# Altium project Activity_Recognition_Board_V1.0.PrjPcb
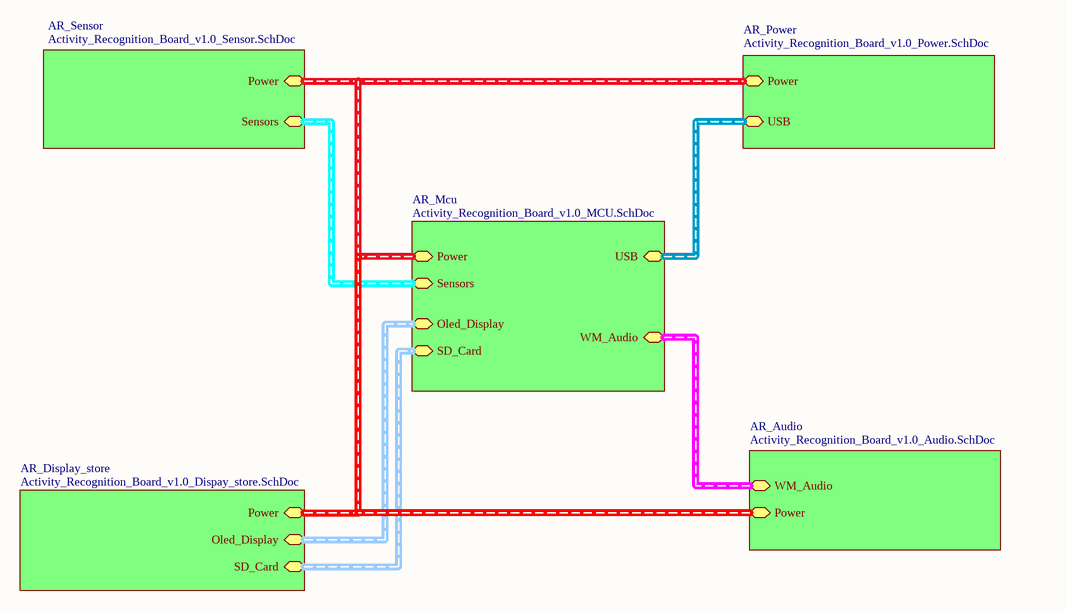
[diagram p0: Activity_Recognition_Board_v1.0_TOP.SchDoc]
7 sheets, 119 parts. Net scope: hierarchical (ports join the sheet entries above them; power ports are global).
Board file: Activity_Recognition_Board_v1.0_PCB.PcbDoc
Sheets:
  Activity_Recognition_Board_v1.0_TOP.SchDoc
    AR_Mcu = Activity_Recognition_Board_v1.0_MCU.SchDoc
    AR_Power = Activity_Recognition_Board_v1.0_Power.SchDoc
    AR_Sensor = Activity_Recognition_Board_v1.0_Sensor.SchDoc
    AR_Display_store = Activity_Recognition_Board_v1.0_Dispay_store.SchDoc
    AR_Audio = Activity_Recognition_Board_v1.0_Audio.SchDoc
  Sheet1.SchDoc

## Sheet Activity_Recognition_Board_v1.0_TOP.SchDoc
size A4

### Sub-sheets
AR_Audio = Activity_Recognition_Board_v1.0_Audio.SchDoc: Power (harness Power), WM_Audio (harness WM_Audio)
AR_Display_store = Activity_Recognition_Board_v1.0_Dispay_store.SchDoc: SD_Card (harness SD_Card), Power (harness Power), Oled_Display (harness Oled_Display)
AR_Mcu = Activity_Recognition_Board_v1.0_MCU.SchDoc: SD_Card (harness SD_Card), Power (harness Power), Sensors (harness Sensors), USB (harness USB), Oled_Display (harness Oled_Display), WM_Audio (harness WM_Audio)
AR_Power = Activity_Recognition_Board_v1.0_Power.SchDoc: Power (harness Power), USB (harness USB)
AR_Sensor = Activity_Recognition_Board_v1.0_Sensor.SchDoc: Sensors (harness Sensors), Power (harness Power)

### Buses and harness runs
harness sheet AR_Audio/Power = sheet AR_Display_store/Power = sheet AR_Mcu/Power = sheet AR_Power/Power = sheet AR_Sensor/Power
harness sheet AR_Audio/WM_Audio = sheet AR_Mcu/WM_Audio
harness sheet AR_Display_store/Oled_Display = sheet AR_Mcu/Oled_Display
harness sheet AR_Display_store/SD_Card = sheet AR_Mcu/SD_Card
harness sheet AR_Mcu/Sensors = sheet AR_Sensor/Sensors
harness sheet AR_Mcu/USB = sheet AR_Power/USB

## Sheet Activity_Recognition_Board_v1.0_MCU.SchDoc
size A4
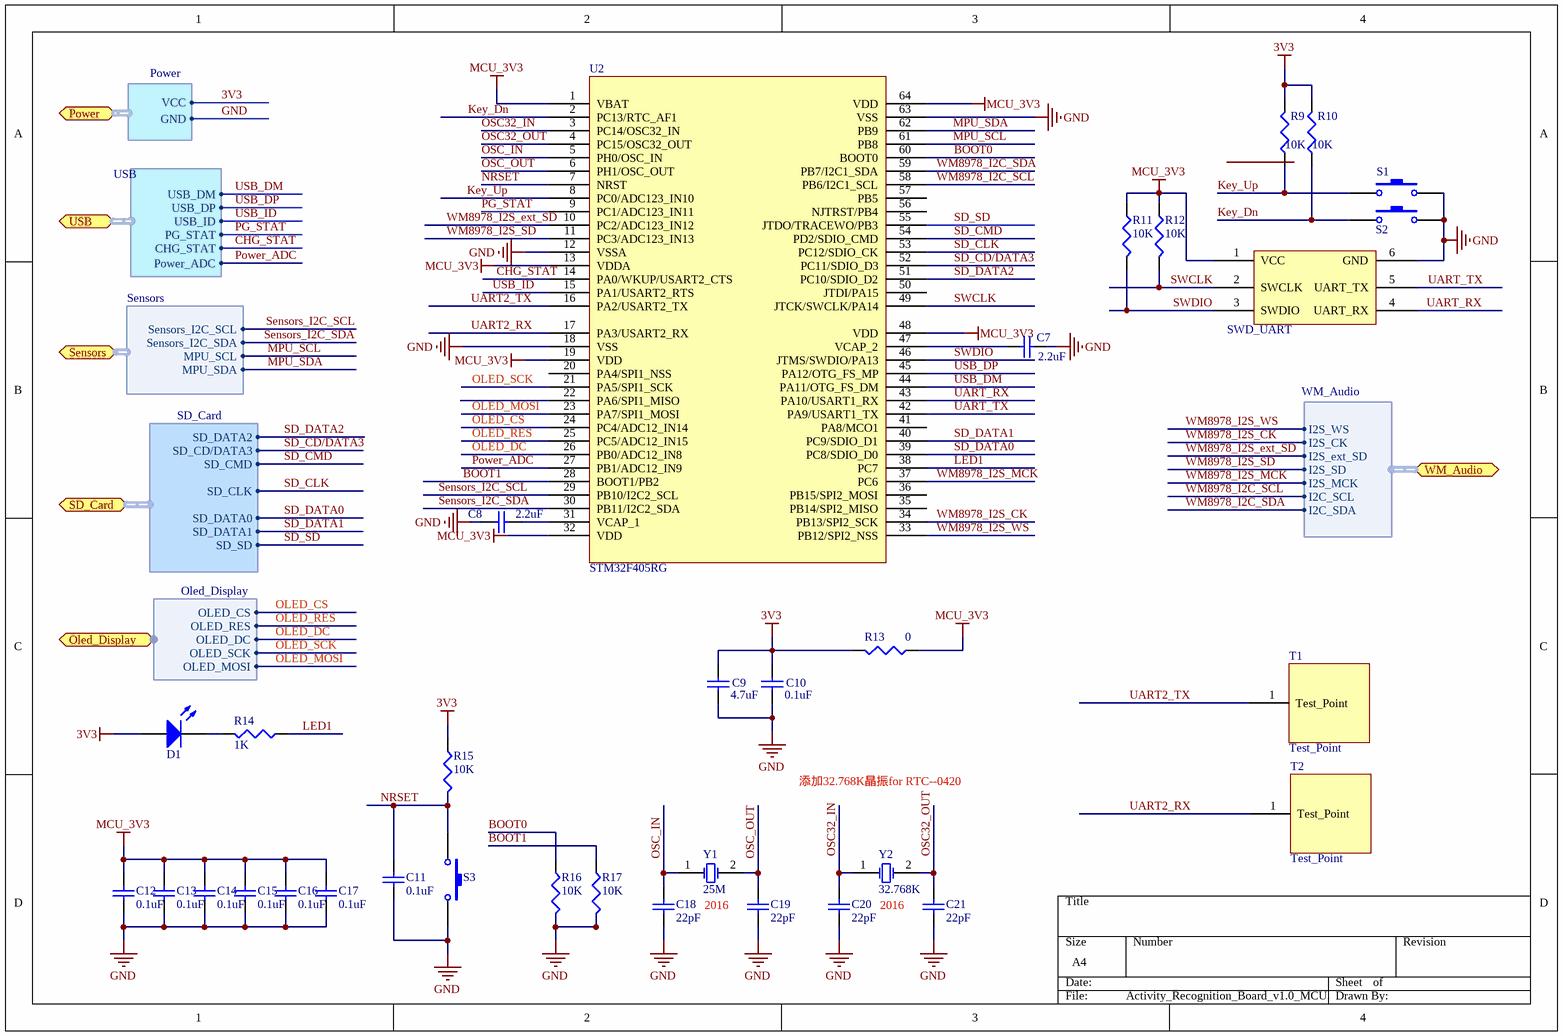
[diagram p1: Activity_Recognition_Board_v1.0_MCU.SchDoc]

### Parts
C7  value 2.2uF  [C0603]  (hidden comment: Cap semi)
C8  value 2.2uF  [C0603]  (hidden comment: Cap semi)
C9  value 4.7uF  [C0603]  (hidden comment: Cap semi)
C10  value 0.1uF  [C0402]  (hidden comment: Cap semi)
C11  value 0.1uF  [C0402]  (hidden comment: Cap semi)
C12  value 0.1uF  [C0402]  (hidden comment: Cap semi)
C13  value 0.1uF  [C0402]  (hidden comment: Cap semi)
C14  value 0.1uF  [C0402]  (hidden comment: Cap semi)
C15  value 0.1uF  [C0402]  (hidden comment: Cap semi)
C16  value 0.1uF  [C0402]  (hidden comment: Cap semi)
C17  value 0.1uF  [C0402]  (hidden comment: Cap semi)
C18  value 22pF  [C0402]  (hidden comment: Cap semi)
C19  value 22pF  [C0402]  (hidden comment: Cap semi)
C20  value 22pF  [C0402]  (hidden comment: Cap semi)
C21  value 22pF  [C0402]  (hidden comment: Cap semi)
D1  LED3  [LED0603]  (value not drawn)
R9  value 10K  [R0402]  (hidden comment: Res3)
R10  value 10K  [R0402]  (hidden comment: Res3)
R11  value 10K  [R0402]  (hidden comment: Res3)
R12  value 10K  [R0402]  (hidden comment: Res3)
R13  value 0  [R0603]  (hidden comment: Res3)
R14  value 1K  [R0402]  (hidden comment: Res3)
R15  value 10K  [R0402]  (hidden comment: Res3)
R16  value 10K  [R0402]  (hidden comment: Res3)
R17  value 10K  [R0402]  (hidden comment: Res3)
S1  SW-PB  [MP34]  (value not drawn)
S2  SW-PB  [MP34]  (value not drawn)
S3  SW-PB  [MP34]  (value not drawn)
SWD_UART1  SWD_UART  [FFC_6]
T1  Test_Point  [Test_Point]
T2  Test_Point  [Test_Point]
U2  STM32F405RG  [LQFP64]
Y1  25M  [3225]
Y2  32.768K  [3215]

### Ports
Oled_Display (harness Oled_Display), Power (harness Power), SD_Card (harness SD_Card), Sensors (harness Sensors), USB (harness USB), WM_Audio (harness WM_Audio)

### Harnesses
Power: VCC, GND
USB: USB_DM, USB_DP, USB_ID, PG_STAT, CHG_STAT, Power_ADC
Sensors: Sensors_I2C_SCL, Sensors_I2C_SDA, MPU_SDA, MPU_SCL
SD_Card: SD_DATA2, SD_CMD, SD_CD/DATA3, SD_CLK, SD_DATA0, SD_DATA1, SD_SD
WM_Audio: I2S_WS, I2S_CK, I2S_ext_SD, I2S_SD, I2S_MCK, I2C_SCL, I2C_SDA
Oled_Display: OLED_CS, OLED_RES, OLED_DC, OLED_SCK, OLED_MOSI

### Nets
3V3: C9.1 C10.1 D1.1(A) R9.2 R10.2 R13.2 R15.1 ; port Power.VCC
GND: C7.1 C8.2 C9.2 C10.2 C11.1 C12.1 C13.1 C14.1 C15.1 C16.1 C17.1 C18.1 C19.1 C20.1 C21.1 R16.2 R17.2 S1.2 S2.2 S3.2 SWD_UART1.6(GND) U2.12(VSSA) U2.18(VSS) U2.63(VSS) ; port Power.GND
MCU_3V3: C12.2 C13.2 C14.2 C15.2 C16.2 C17.2 R11.1 R12.1 R13.1 SWD_UART1.1(VCC) U2.1(VBAT) U2.13(VDDA) U2.19(VDD) U2.32(VDD) U2.48(VDD) U2.64(VDD)
BOOT0: R16.1 U2.60(BOOT0)
BOOT1: R17.1 U2.28(BOOT1/PB2)
CHG_STAT: U2.14(PA0/WKUP/USART2_CTS) ; port USB.CHG_STAT
Key_Dn: R10.1 S2.1 U2.2(PC13/RTC_AF1)
Key_Up: R9.1 S1.1 U2.8(PC0/ADC123_IN10)
LED1: R14.1 U2.38(PC7)
MPU_SCL: U2.61(PB8) ; port Sensors.MPU_SCL
MPU_SDA: U2.62(PB9) ; port Sensors.MPU_SDA
NRSET: C11.2 R15.2 S3.1 U2.7(NRST)
OLED_CS: U2.24(PC4/ADC12_IN14) ; port Oled_Display.OLED_CS
OLED_DC: U2.26(PB0/ADC12_IN8) ; port Oled_Display.OLED_DC
OLED_MOSI: U2.23(PA7/SPI1_MOSI) ; port Oled_Display.OLED_MOSI
OLED_RES: U2.25(PC5/ADC12_IN15) ; port Oled_Display.OLED_RES
OLED_SCK: U2.21(PA5/SPI1_SCK) ; port Oled_Display.OLED_SCK
OSC32_IN: C20.2 U2.3(PC14/OSC32_IN) Y2.1(OSC1)
OSC32_OUT: C21.2 U2.4(PC15/OSC32_OUT) Y2.2(OSC2)
OSC_IN: C18.2 U2.5(PH0/OSC_IN) Y1.1(OSC1)
OSC_OUT: C19.2 U2.6(PH1/OSC_OUT) Y1.2(OSC2)
PG_STAT: U2.9(PC1/ADC123_IN11) ; port USB.PG_STAT
Power_ADC: U2.27(PB1/ADC12_IN9) ; port USB.Power_ADC
SD_CD/DATA3: U2.52(PC11/SDIO_D3) ; port SD_Card.SD_CD/DATA3
SD_CLK: U2.53(PC12/SDIO_CK) ; port SD_Card.SD_CLK
SD_CMD: U2.54(PD2/SDIO_CMD) ; port SD_Card.SD_CMD
SD_DATA0: U2.39(PC8/SDIO_D0) ; port SD_Card.SD_DATA0
SD_DATA1: U2.40(PC9/SDIO_D1) ; port SD_Card.SD_DATA1
SD_DATA2: U2.51(PC10/SDIO_D2) ; port SD_Card.SD_DATA2
SD_SD: U2.55(JTDO/TRACEWO/PB3) ; port SD_Card.SD_SD
Sensors_I2C_SCL: U2.29(PB10/I2C2_SCL) ; port Sensors.Sensors_I2C_SCL
Sensors_I2C_SDA: U2.30(PB11/I2C2_SDA) ; port Sensors.Sensors_I2C_SDA
SWCLK: R12.2 SWD_UART1.2(SWCLK) U2.49(JTCK/SWCLK/PA14)
SWDIO: R11.2 SWD_UART1.3(SWDIO) U2.46(JTMS/SWDIO/PA13)
UART2_RX: T2.1(Test_Point) U2.17(PA3/USART2_RX)
UART2_TX: T1.1(Test_Point) U2.16(PA2/USART2_TX)
UART_RX: SWD_UART1.4(UART_RX) U2.43(PA10/USART1_RX)
UART_TX: SWD_UART1.5(UART_TX) U2.42(PA9/USART1_TX)
USB_DM: U2.44(PA11/OTG_FS_DM) ; port USB.USB_DM
USB_DP: U2.45(PA12/OTG_FS_MP) ; port USB.USB_DP
USB_ID: U2.15(PA1/USART2_RTS) ; port USB.USB_ID
WM8978_I2C_SCL: U2.58(PB6/I2C1_SCL) ; port WM_Audio.I2C_SCL  [project net I2C_SCL]
WM8978_I2C_SDA: U2.59(PB7/I2C1_SDA) ; port WM_Audio.I2C_SDA  [project net I2C_SDA]
WM8978_I2S_CK: U2.34(PB13/SPI2_SCK) ; port WM_Audio.I2S_CK  [project net I2S_CK]
WM8978_I2S_ext_SD: U2.10(PC2/ADC123_IN12) ; port WM_Audio.I2S_ext_SD  [project net I2S_ext_SD]
WM8978_I2S_MCK: U2.37(PC6) ; port WM_Audio.I2S_MCK  [project net I2S_MCK]
WM8978_I2S_SD: U2.11(PC3/ADC123_IN13) ; port WM_Audio.I2S_SD  [project net I2S_SD]
WM8978_I2S_WS: U2.33(PB12/SPI2_NSS) ; port WM_Audio.I2S_WS  [project net I2S_WS]
NetC7_2: C7.2 U2.47(VCAP_2)
NetC8_1: C8.1 U2.31(VCAP_1)
NetD1_2: D1.2(K) R14.2

Not connected (* = marked no-connect by the designer): U2 20(PA4/SPI1_NSS) 22(PA6/SPI1_MISO) 35(PB14/SPI2_MISO) 36(PB15/SPI2_MOSI) 41(PA8/MCO1) 50(JTDI/PA15) 56(NJTRST/PB4) 57(PB5)

### Notes on the sheet
- 添加32.768K晶振for RTC--0420
- 2016

### Library data of the parts
C7-C21 = Cap semi: Capacitor (Semiconductor SIM Model); Published: 8-Jun-2000; LatestRevisionDate: 29-May-2009; LatestRevisionNote: IPC-7351 Footprint Added.; PackageReference: C1206; Publisher: Altium Limited; PackageDescription: Chip Capacitor
D1 = LED3: Typical BLUE SiC LED; Published: 8-Jun-2000; LatestRevisionDate: 17-Dec-2003; LatestRevisionNote: PCB Footprint replaced.; DatasheetVersion: 16-Apr-2002; PackageVersion: 16-Apr-2002; PackageReference: 3.5X2.8X1.9; Publisher: Altium Limited; PackageDescription: SM LED; 2 C-Bend Leads; Body 3.5 x 2.8 x 1.9 mm, inc leads (LxWxH typ)
R9-R17 = Res3: Resistor; Published: 8-Jun-2000; LatestRevisionDate: 29-May-2009; LatestRevisionNote: IPC-7351 Footprint Added.; PackageReference: J1-0603; Publisher: Altium Limited; PackageDescription: Chip Resistor
S1-S3 = SW-PB: Switch; Published: 24-Mar-1999; LatestRevisionDate: 17-Jul-2002; LatestRevisionNote: Re-released for DXP Platform.; PackageReference: SPST-2; Publisher: Altium Limited; PackageDescription: Switch; 2 Leads
Y1 = XTAL: Crystal Oscillator; pin to pad: 2>3; Published: 8-Jun-2000; LatestRevisionDate: 17-Jul-2002; LatestRevisionNote: Re-released for DXP Platform.; PackageReference: R38; Publisher: Altium Limited; PackageDescription: Crystal, Thru-Hole; 2 Leads; Body 3.1 x 8.2 mm (Dia.xH)
Y2 = XTAL: Crystal Oscillator; Published: 8-Jun-2000; LatestRevisionDate: 17-Jul-2002; LatestRevisionNote: Re-released for DXP Platform.; PackageReference: R38; Publisher: Altium Limited; PackageDescription: Crystal, Thru-Hole; 2 Leads; Body 3.1 x 8.2 mm (Dia.xH)

## Sheet Activity_Recognition_Board_v1.0_Power.SchDoc
size A4
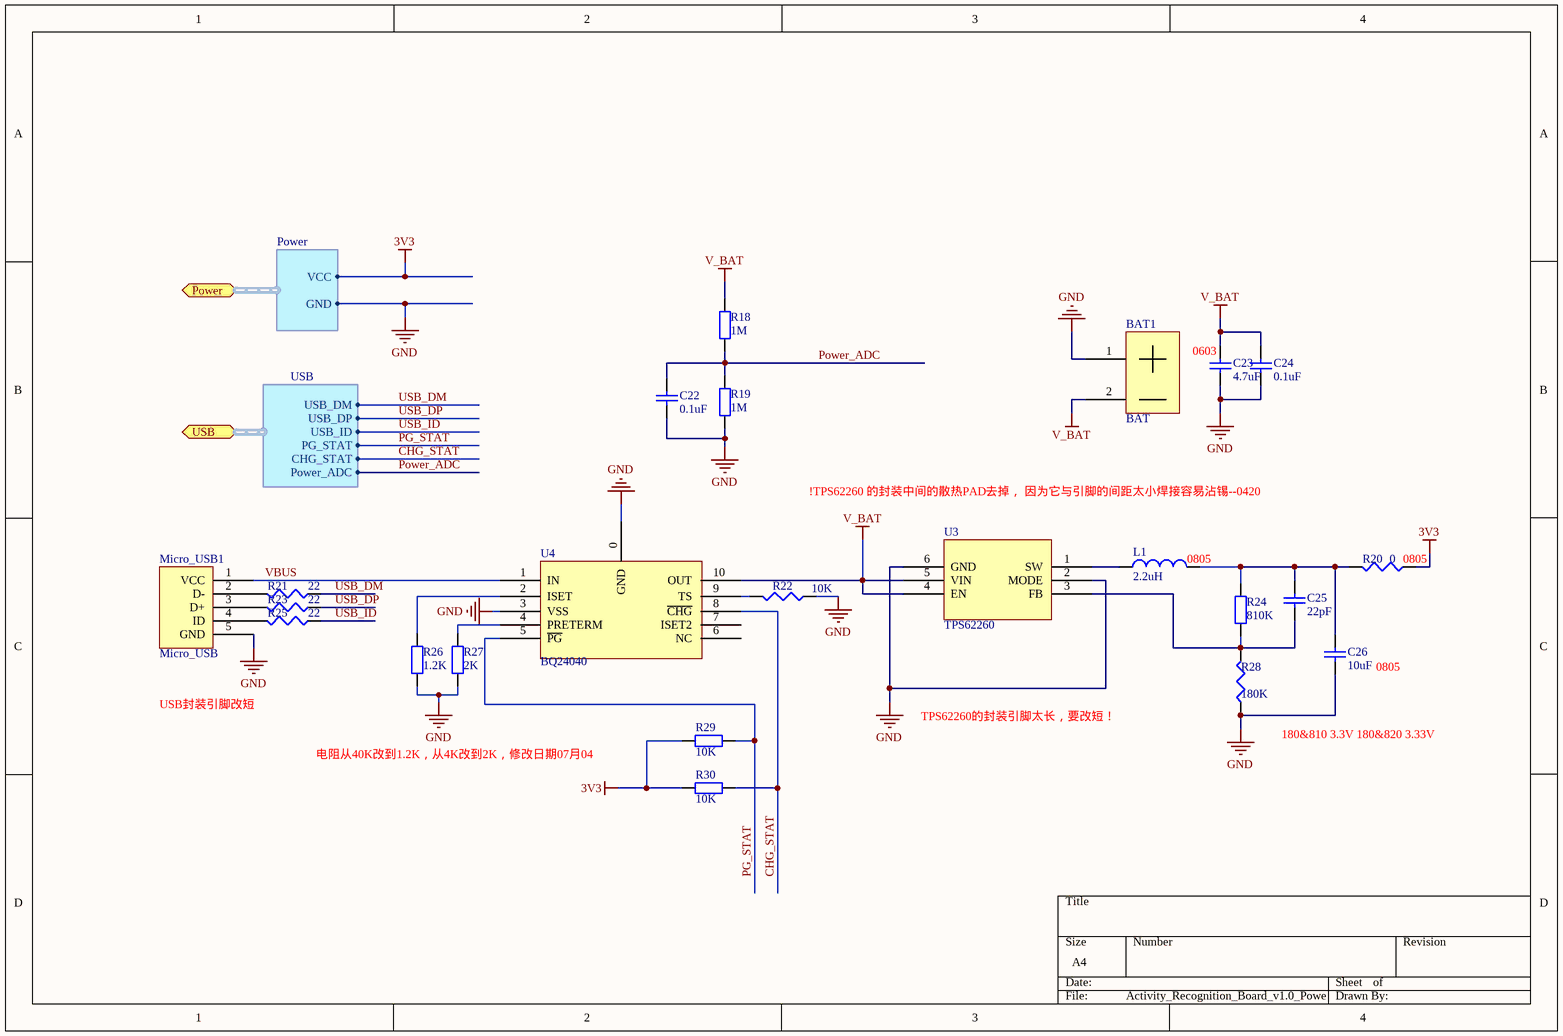
[diagram p2: Activity_Recognition_Board_v1.0_Power.SchDoc]

### Parts
(Parts that share a designator on the sheet are numbered #1, #2 ... from top to bottom, then left to right.)
BAT1  BAT  [BHDR2_1.87]
C22  value 0.1uF  [C0402]  (hidden comment: Cap semi)
C23  value 4.7uF  [C0603]  (hidden comment: Cap semi)
C24  value 0.1uF  [C0402]  (hidden comment: Cap semi)
C25  value 22pF  [C0402]  (hidden comment: Cap semi)
C26  value 10uF  [C0805]  (hidden comment: Cap semi)
L1#1  value 2.2uH  [L0805]  (hidden comment: Inductor)
Micro_USB1  Micro_USB  [Micro_USB]
R18  value 1M  [R0402]  (hidden comment: Res2)
R19  value 1M  [R0402]  (hidden comment: Res2)
R20  value 0  [R0805]  (hidden comment: Res3)
R21  value 22  [R0402]  (hidden comment: Res3)
R22  value 10K  [R0402]  (hidden comment: Res3)
R23  value 22  [R0402]  (hidden comment: Res3)
R24  value 810K  [R0402]  (hidden comment: Res2)
R25  value 22  [R0402]  (hidden comment: Res3)
R26  value 1.2K  [R0402]  (hidden comment: Res2)
R27  value 2K  [R0402]  (hidden comment: Res2)
R28  value 180K  [R0402]  (hidden comment: Res3)
R29  value 10K  [R0402]  (hidden comment: Res2)
R30  value 10K  [R0402]  (hidden comment: Res2)
U3  TPS62260  [QFN-6]
U4  BQ24040  [WSON10]

### Ports
Power (harness Power), USB (harness USB)

### Harnesses
Power: VCC, GND
USB: USB_DM, USB_DP, USB_ID, PG_STAT, CHG_STAT, Power_ADC

### Nets
3V3: R20.1 R29.1 R30.1 ; port Power.VCC
GND: BAT1.1(+) C22.1 C23.1 C24.1 C26.1 Micro_USB1.5(GND) R19.2 R22.1 R26.1 R27.1 R28.1 U3.2(MODE) U3.6(GND) U4.0(GND) U4.3(VSS) ; port Power.GND
V_BAT: BAT1.2(-) C23.2 C24.2 R18.1 U3.4(EN) U3.5(VIN) U4.10(OUT)
CHG_STAT: R30.2 U4.8(~{CHG}) ; port USB.CHG_STAT
PG_STAT: R29.2 U4.5(~{PG}) ; port USB.PG_STAT
Power_ADC: C22.2 R18.2 R19.1 ; port USB.Power_ADC
USB_DM: R21.1 ; port USB.USB_DM
USB_DP: R23.1 ; port USB.USB_DP
USB_ID: R25.1 ; port USB.USB_ID
VBUS: Micro_USB1.1(VCC) U4.1(IN)
NetC25_1: C25.1 R24.1 R28.2 U3.3(FB)
NetC25_2: C25.2 C26.2 L1#1.2 R20.2 R24.2
NetL1#1_1: L1#1.1 U3.1(SW)
NetMicro_USB1_2: Micro_USB1.2(D-) R21.2
NetMicro_USB1_3: Micro_USB1.3(D+) R23.2
NetMicro_USB1_4: Micro_USB1.4(ID) R25.2
NetR22_2: R22.2 U4.9(TS)
NetR26_2: R26.2 U4.2(ISET)
NetR27_2: R27.2 U4.4(PRETERM)

Not connected (* = marked no-connect by the designer): U4 6(NC) 7(ISET2)

### Notes on the sheet
- (near C23) 0603
- !TPS62260 的封装中间的散热PAD去掉， 因为它与引脚的间距太小焊接容易沾锡--0420
- (near L1#1) 0805
- (near R20) 0805
- (near C26) 0805
- 180&810 3.3V 180&820 3.33V
- Labels drawn without touching a wire or pin: TPS62260的封装引脚太长，要改短！, USB封装引脚改短, 电阻从40K改到1.2K，从4K改到2K，修改日期07月04

### Library data of the parts
BAT1 = BAT_CN
C22-C26 = Cap semi: Capacitor (Semiconductor SIM Model); Published: 8-Jun-2000; LatestRevisionDate: 29-May-2009; LatestRevisionNote: IPC-7351 Footprint Added.; PackageReference: C1206; Publisher: Altium Limited; PackageDescription: Chip Capacitor
L1#1 = Inductor: Code_IEC: 1005; Published: 8-Jun-2000; LatestRevisionDate: 29-May-2009; LatestRevisionNote: IPC-7351 Footprint Added.; PackageReference: 0402-A; Publisher: Altium Limited; PackageDescription: Chip Inductor; Code_JEITA: 0402
Micro_USB1 = Micri_USB
R18 R19 R24 R26 R27 R29 R30 = Res2: Resistor; Published: 8-Jun-2000; LatestRevisionDate: 17-Jul-2002; LatestRevisionNote: Re-released for DXP Platform.; PackageReference: AXIAL-0.4; Publisher: Altium Limited
R20-R23 R25 R28 = Res3: Resistor; Published: 8-Jun-2000; LatestRevisionDate: 29-May-2009; LatestRevisionNote: IPC-7351 Footprint Added.; PackageReference: J1-0603; Publisher: Altium Limited; PackageDescription: Chip Resistor
U3 = TPS62260: DC-DC buck

## Sheet Activity_Recognition_Board_v1.0_Sensor.SchDoc
size A4
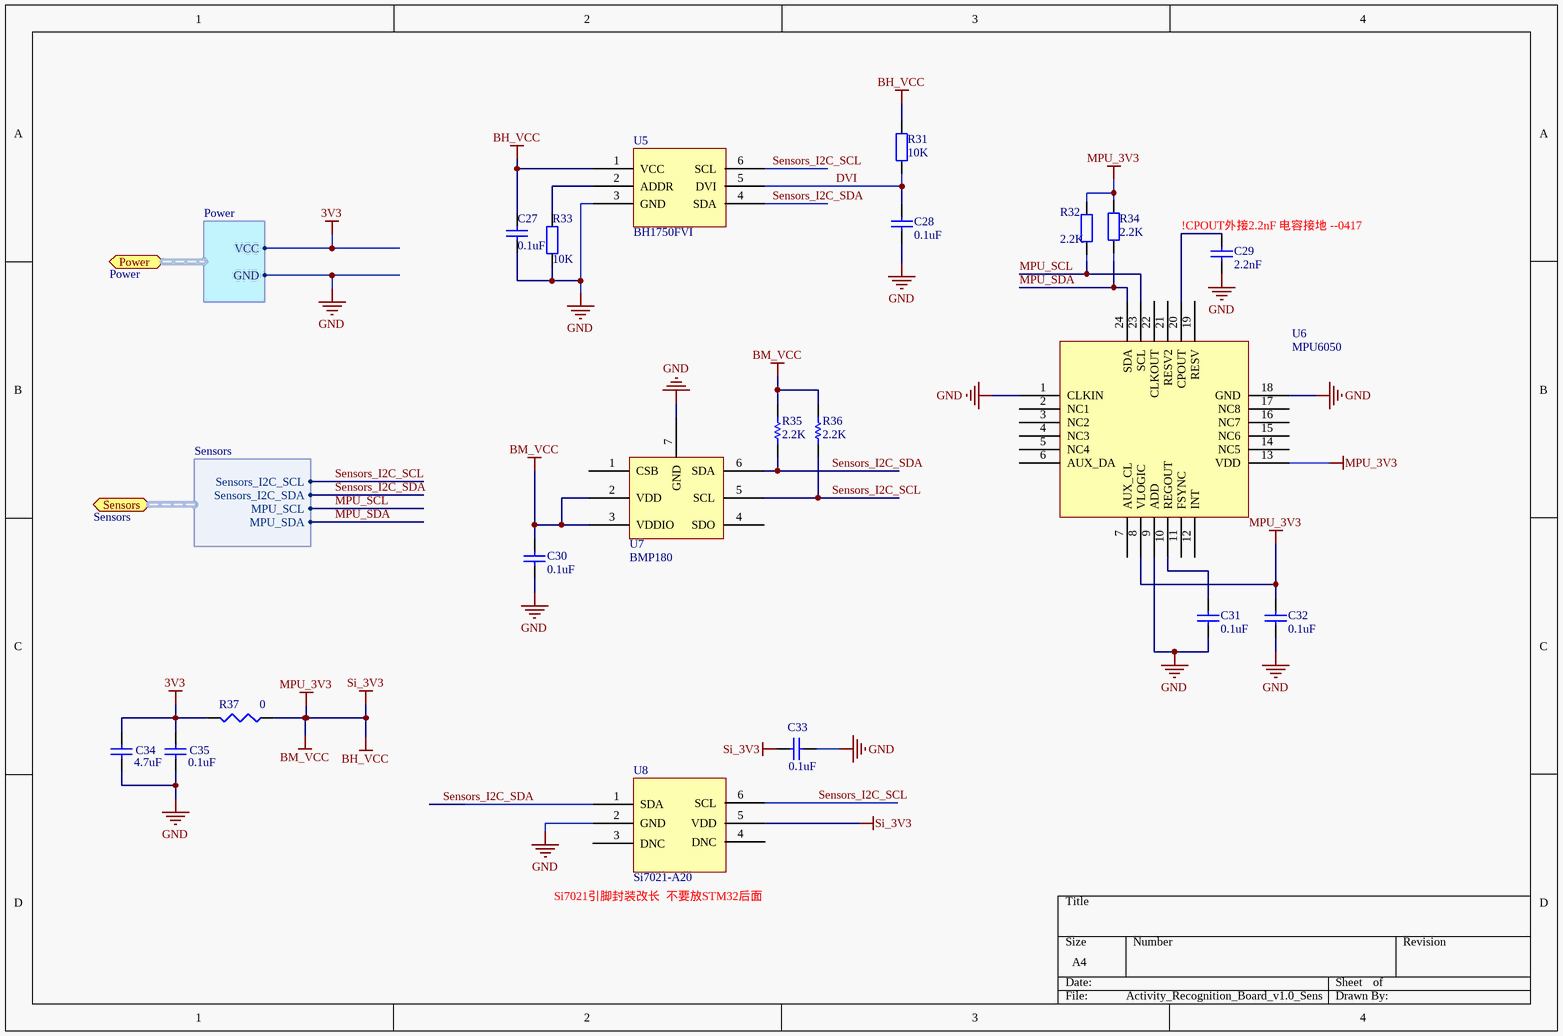
[diagram p3: Activity_Recognition_Board_v1.0_Sensor.SchDoc]

### Parts
C27  value 0.1uF  [C0402]  (hidden comment: Cap semi)
C28  value 0.1uF  [C0402]  (hidden comment: Cap semi)
C29  value 2.2nF  [C0402]  (hidden comment: Cap semi)
C30  value 0.1uF  [C0402]  (hidden comment: Cap semi)
C31  value 0.1uF  [C0402]  (hidden comment: Cap semi)
C32  value 0.1uF  [C0402]  (hidden comment: Cap semi)
C33  value 0.1uF  [C0402]  (hidden comment: Cap semi)
C34  value 4.7uF  [C0603]  (hidden comment: Cap semi)
C35  value 0.1uF  [C0402]  (hidden comment: Cap semi)
R31  value 10K  [R0402]  (hidden comment: Res2)
R32  value 2.2K  [R0402]  (hidden comment: Res2)
R33  value 10K  [R0402]  (hidden comment: Res2)
R34  value 2.2K  [R0402]  (hidden comment: Res2)
R35  value 2.2K  [R0402]  (hidden comment: Res1)
R36  value 2.2K  [R0402]  (hidden comment: Res1)
R37  value 0  [R0402]  (hidden comment: Res3)
U5  BH1750FVI  [WSOF6I]
U6  MPU6050  [QFN-24]
U7  BMP180  [LGA7]
U8  Si7021-A20  [Si7021-A10]

### Ports
Power (harness Power), Sensors (harness Sensors)

### Harnesses
Power: VCC, GND
Sensors: Sensors_I2C_SCL, Sensors_I2C_SDA, MPU_SDA, MPU_SCL

### Nets
3V3: C34.1 C35.1 R37.2 ; port Power.VCC
BH_VCC: C27.2 C30.2 C32.1 C33.2 R31.1 R32.2 R34.2 R35.2 R36.2 R37.1 U5.1(VCC) U6.8(VLOGIC) U6.13(VDD) U7.2(VDD) U7.3(VDDIO) U8.5(VDD)  [also labelled BM_VCC, MPU_3V3, Si_3V3]
GND: C27.1 C28.1 C29.2 C30.1 C31.2 C32.2 C33.1 C34.2 C35.2 R33.2 U5.3(GND) U6.1(CLKIN) U6.9(ADD) U6.18(GND) U7.7(GND) U8.2(GND) ; port Power.GND
DVI: C28.2 R31.2 U5.5(DVI)
MPU_SCL: R32.1 U6.23(SCL) ; port Sensors.MPU_SCL
MPU_SDA: R34.1 U6.24(SDA) ; port Sensors.MPU_SDA
Sensors_I2C_SCL: R36.1 U5.6(SCL) U7.5(SCL) U8.6(SCL) ; port Sensors.Sensors_I2C_SCL
Sensors_I2C_SDA: R35.1 U5.4(SDA) U7.6(SDA) U8.1(SDA) ; port Sensors.Sensors_I2C_SDA
NetC29_1: C29.1 U6.20(CPOUT)
NetC31_1: C31.1 U6.10(REGOUT)
NetR33_1: R33.1 U5.2(ADDR)

Not connected (* = marked no-connect by the designer): U6 2(NC1) 3(NC2) 4(NC3) 5(NC4) 6(AUX_DA) 7(AUX_CL) 11(FSYNC) 12(INT) 14(NC5) 15(NC6) 16(NC7) 17(NC8) 19(RESV) 21(RESV2) 22(CLKOUT); U7 1(CSB) 4(SDO); U8 3(DNC) 4(DNC)

### Notes on the sheet
- (near C29) !CPOUT外接2.2nF 电容接地 --0417
- Labels drawn without touching a wire or pin: Si7021引脚封装改长  不要放STM32后面

### Library data of the parts
C27-C35 = Cap semi: Capacitor (Semiconductor SIM Model); Published: 8-Jun-2000; LatestRevisionDate: 29-May-2009; LatestRevisionNote: IPC-7351 Footprint Added.; PackageReference: C1206; Publisher: Altium Limited; PackageDescription: Chip Capacitor
R31-R34 = Res2: Resistor; Published: 8-Jun-2000; LatestRevisionDate: 17-Jul-2002; LatestRevisionNote: Re-released for DXP Platform.; PackageReference: AXIAL-0.4; Publisher: Altium Limited
R35 R36 = Res1: Resistor; Published: 8-Jun-2000; LatestRevisionDate: 17-Jul-2002; LatestRevisionNote: Re-released for DXP Platform.; PackageReference: AXIAL-0.3; Publisher: Altium Limited
R37 = Res3: Resistor; Published: 8-Jun-2000; LatestRevisionDate: 29-May-2009; LatestRevisionNote: IPC-7351 Footprint Added.; PackageReference: J1-0603; Publisher: Altium Limited; PackageDescription: Chip Resistor

## Sheet Activity_Recognition_Board_v1.0_Dispay_store.SchDoc
size A4
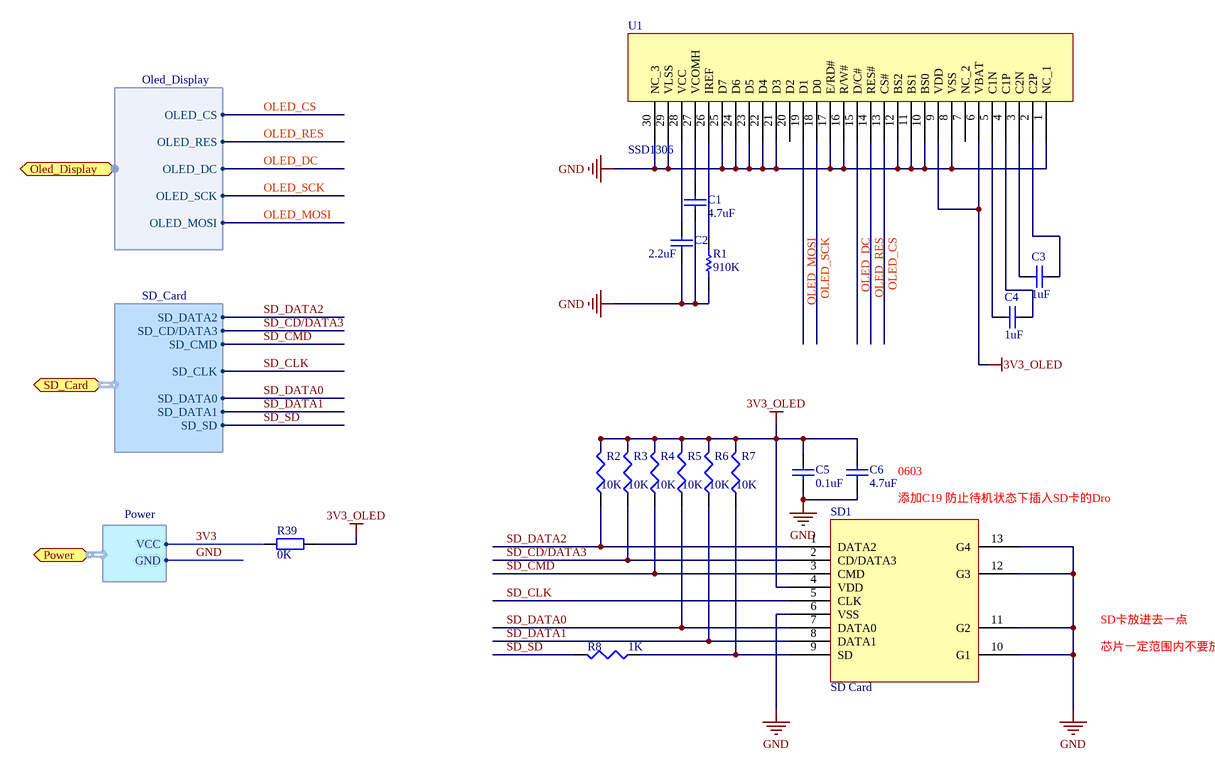
[diagram p4: Activity_Recognition_Board_v1.0_Dispay_store.SchDoc]

### Parts
(Parts that share a designator on the sheet are numbered #1, #2 ... from top to bottom, then left to right.)
C1#1  value 4.7uF  [C0603]  (hidden comment: Cap)
C2#1  value 2.2uF  [C0603]  (hidden comment: Cap)
C3  value 1uF  [C0402]  (hidden comment: Cap)
C4  value 1uF  [C0402]  (hidden comment: Cap)
C5  value 0.1uF  [C0402]  (hidden comment: Cap semi)
C6  value 4.7uF  [C0603]  (hidden comment: Cap semi)
R1#1  value 910K  [R0402]  (hidden comment: Res1)
R2#1  value 10K  [R0402]  (hidden comment: Res3)
R3  value 10K  [R0402]  (hidden comment: Res3)
R4  value 10K  [R0402]  (hidden comment: Res3)
R5  value 10K  [R0402]  (hidden comment: Res3)
R6  value 10K  [R0402]  (hidden comment: Res3)
R7  value 10K  [R0402]  (hidden comment: Res3)
R8  value 1K  [R0402]  (hidden comment: Res3)
R39  value 0K  [C0603]  (hidden comment: Res2)
SD1  SD Card  [SDCARD-M]
U1  SSD1306  [OLED_Bare]

### Ports
Oled_Display (harness Oled_Display), Power (harness Power), SD_Card (harness SD_Card)

### Harnesses
Power: VCC, GND
SD_Card: SD_DATA2, SD_CMD, SD_CD/DATA3, SD_CLK, SD_DATA0, SD_DATA1, SD_SD
Oled_Display: OLED_CS, OLED_RES, OLED_DC, OLED_SCK, OLED_MOSI

### Nets
3V3: R39.2 ; port Power.VCC
3V3_OLED: C5.2 C6.2 R2#1.2 R3.2 R4.2 R5.2 R6.2 R7.2 R39.1 SD1.4(VDD) U1.6(VBAT) U1.9(VDD)
GND: C1#1.2 C2#1.2 C5.1 C6.1 R1#1.2 SD1.6(VSS) SD1.10(G1) SD1.11(G2) SD1.12(G3) SD1.13(G4) U1.1(NC_1) U1.8(VSS) U1.10(BS0) U1.11(BS1) U1.12(BS2) U1.16(R/W#) U1.17(E/RD#) U1.21(D3) U1.22(D4) U1.23(D5) U1.24(D6) U1.25(D7) U1.29(VLSS) U1.30(NC_3) ; port Power.GND
OLED_CS: U1.13(CS#) ; port Oled_Display.OLED_CS
OLED_DC: U1.15(D/C#) ; port Oled_Display.OLED_DC
OLED_MOSI: U1.19(D1) ; port Oled_Display.OLED_MOSI
OLED_RES: U1.14(RES#) ; port Oled_Display.OLED_RES
OLED_SCK: U1.18(D0) ; port Oled_Display.OLED_SCK
SD_CD/DATA3: R3.1 SD1.2(CD/DATA3) ; port SD_Card.SD_CD/DATA3
SD_CLK: SD1.5(CLK) ; port SD_Card.SD_CLK
SD_CMD: R4.1 SD1.3(CMD) ; port SD_Card.SD_CMD
SD_DATA0: R5.1 SD1.7(DATA0) ; port SD_Card.SD_DATA0
SD_DATA1: R6.1 SD1.8(DATA1) ; port SD_Card.SD_DATA1
SD_DATA2: R2#1.1 SD1.1(DATA2) ; port SD_Card.SD_DATA2
SD_SD: R8.2 ; port SD_Card.SD_SD
NetC1#1_1: C1#1.1 U1.27(VCOMH)
NetC2#1_1: C2#1.1 U1.28(VCC)
NetC3_1: C3.1 U1.2(C2P)
NetC3_2: C3.2 U1.3(C2N)
NetC4_1: C4.1 U1.4(C1P)
NetC4_2: C4.2 U1.5(C1N)
NetR1#1_1: R1#1.1 U1.26(IREF)
NetR7_1: R7.1 R8.1 SD1.9(SD)

Not connected (* = marked no-connect by the designer): U1 7(NC_2) 20(D2)

### Notes on the sheet
- (near C6) 0603
- 添加C19 防止待机状态下插入SD卡的Dro
- Labels drawn without touching a wire or pin: SD卡放进去一点, 芯片一定范围内不要放电阻电容

### Library data of the parts
C1#1 C2#1 C3 C4 = Cap: Capacitor; Published: 8-Jun-2000; LatestRevisionDate: 17-Jul-2002; LatestRevisionNote: Re-released for DXP Platform.; PackageReference: RAD-0.3; Publisher: Altium Limited
C5 C6 = Cap semi: Capacitor (Semiconductor SIM Model); Published: 8-Jun-2000; LatestRevisionDate: 29-May-2009; LatestRevisionNote: IPC-7351 Footprint Added.; PackageReference: C1206; Publisher: Altium Limited; PackageDescription: Chip Capacitor
R1#1 = Res1: Resistor; Published: 8-Jun-2000; LatestRevisionDate: 17-Jul-2002; LatestRevisionNote: Re-released for DXP Platform.; PackageReference: AXIAL-0.3; Publisher: Altium Limited
R2#1 R3-R8 = Res3: Resistor; Published: 8-Jun-2000; LatestRevisionDate: 29-May-2009; LatestRevisionNote: IPC-7351 Footprint Added.; PackageReference: J1-0603; Publisher: Altium Limited; PackageDescription: Chip Resistor
R39 = Res2: Resistor; Published: 8-Jun-2000; LatestRevisionDate: 17-Jul-2002; LatestRevisionNote: Re-released for DXP Platform.; PackageReference: AXIAL-0.4; Publisher: Altium Limited
SD1 = Micro_SD_Card: SD card socket

## Sheet Activity_Recognition_Board_v1.0_Audio.SchDoc
size A4
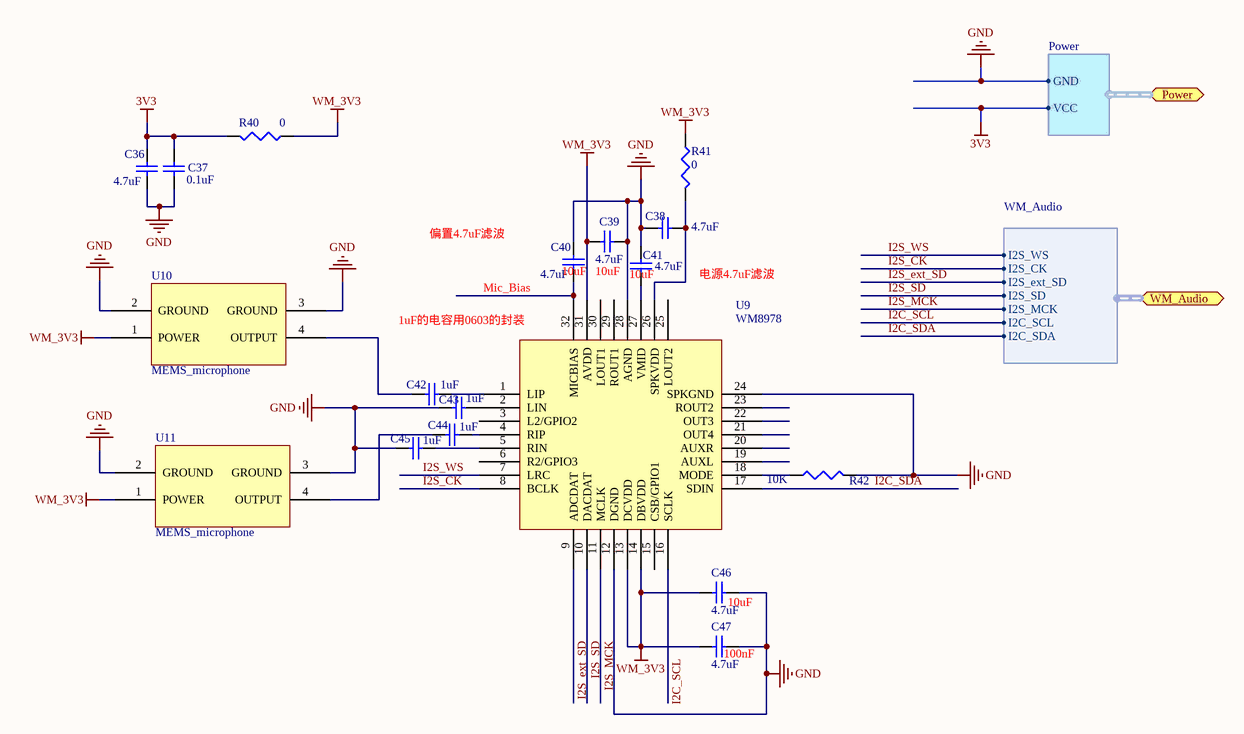
[diagram p5: Activity_Recognition_Board_v1.0_Audio.SchDoc]

### Parts
C36  value 4.7uF  [C0603]  (hidden comment: Cap semi)
C37  value 0.1uF  [C0402]  (hidden comment: Cap semi)
C38  value 4.7uF  [C0603]  (hidden comment: Cap semi)
C39  value 4.7uF  [C0603]  (hidden comment: Cap semi)
C40  value 4.7uF  [C0603]  (hidden comment: Cap semi)
C41  value 4.7uF  [C0603]  (hidden comment: Cap semi)
C42  value 1uF  [C0603]  (hidden comment: Cap semi)
C43  value 1uF  [C0603]  (hidden comment: Cap semi)
C44  value 1uF  [C0603]  (hidden comment: Cap semi)
C45  value 1uF  [C0603]  (hidden comment: Cap semi)
C46  value 4.7uF  [C0603]  (hidden comment: Cap semi)
C47  value 4.7uF  [C0603]  (hidden comment: Cap semi)
R40  value 0  [R0603]  (hidden comment: Res3)
R41  value 0  [R0402]  (hidden comment: Res3)
R42  value 10K  [R0402]  (hidden comment: Res3)
U9  WM8978  [QFN32]
U10  MEMS_microphone  [Microphone]
U11  MEMS_microphone  [Microphone]

### Ports
Power (harness Power), WM_Audio (harness WM_Audio)

### Harnesses
Power: VCC, GND
WM_Audio: I2S_WS, I2S_CK, I2S_ext_SD, I2S_SD, I2S_MCK, I2C_SCL, I2C_SDA

### Nets
3V3: C36.1 C37.1 R40.2 ; port Power.VCC
GND: C36.2 C37.2 C38.1 C39.2 C40.1 C41.1 C43.2 C45.2 C46.2 C47.2 R42.2 U9.12(DGND) U9.24(SPKGND) U9.28(AGND) U10.2(GROUND) U10.3(GROUND) U11.2(GROUND) U11.3(GROUND) ; port Power.GND
WM_3V3: C39.1 C46.1 C47.1 R40.1 R41.1 U9.13(DCVDD) U9.14(DBVDD) U9.31(AVDD) U10.1(POWER) U11.1(POWER)
I2C_SCL: U9.16(SCLK) ; port WM_Audio.I2C_SCL
I2C_SDA: U9.17(SDIN) ; port WM_Audio.I2C_SDA
I2S_CK: U9.8(BCLK) ; port WM_Audio.I2S_CK
I2S_ext_SD: U9.9(ADCDAT) ; port WM_Audio.I2S_ext_SD
I2S_MCK: U9.11(MCLK) ; port WM_Audio.I2S_MCK
I2S_SD: U9.10(DACDAT) ; port WM_Audio.I2S_SD
I2S_WS: U9.7(LRC) ; port WM_Audio.I2S_WS
Mic_Bias: C40.2 U9.32(MICBIAS)
NetC38_2: C38.2 R41.2 U9.26(SPKVDD)
NetC41_2: C41.2 U9.27(VMID)
NetC42_1: C42.1 U9.1(LIP)
NetC42_2: C42.2 U10.4(OUTPUT)
NetC43_1: C43.1 U9.2(LIN)
NetC44_1: C44.1 U9.4(RIP)
NetC44_2: C44.2 U11.4(OUTPUT)
NetC45_1: C45.1 U9.5(RIN)
NetR42_1: R42.1 U9.18(MODE)

Not connected (* = marked no-connect by the designer): U9 3(L2/GPIO2) 6(R2/GPIO3) 15(CSB/GPIO1) 19(AUXL) 20(AUXR) 21(OUT4) 22(OUT3) 23(ROUT2) 25(LOUT2) 29(ROUT1) 30(LOUT1)

### Notes on the sheet
- (near C40) 10uF
- 10uF
- (near C41) 10uF
- (near C46) 10uF
- (near C47) 100nF
- Labels drawn without touching a wire or pin: 1uF的电容用0603的封装, 偏置4.7uF滤波, 电源4.7uF滤波

### Library data of the parts
C36-C47 = Cap semi: Capacitor (Semiconductor SIM Model); Published: 8-Jun-2000; LatestRevisionDate: 29-May-2009; LatestRevisionNote: IPC-7351 Footprint Added.; PackageReference: C1206; Publisher: Altium Limited; PackageDescription: Chip Capacitor
R40-R42 = Res3: Resistor; Published: 8-Jun-2000; LatestRevisionDate: 29-May-2009; LatestRevisionNote: IPC-7351 Footprint Added.; PackageReference: J1-0603; Publisher: Altium Limited; PackageDescription: Chip Resistor

## Sheet Sheet1.SchDoc
size A4
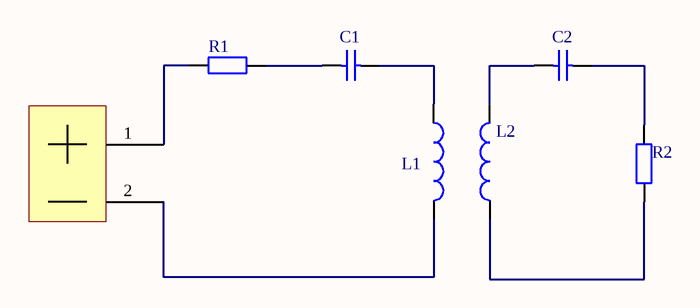
[diagram p6: Sheet1.SchDoc]

### Parts
(Parts that share a designator on the sheet are numbered #1, #2 ... from top to bottom, then left to right.)
BAT?  BAT  [BHDR2_1.87]  (value not drawn)
C1#2  Cap semi  [C0402]  (value not drawn)
C2#2  Cap semi  [C0402]  (value not drawn)
L1#2  Inductor  [L0805]  (value not drawn)
L2  Inductor  [L0805]  (value not drawn)
R1#2  Res2  [R0402]  (value not drawn)
R2#2  Res2  [R0402]  (value not drawn)

### Nets
NetBAT?_1: BAT?.1(+) R1#2.1
NetBAT?_2: BAT?.2(-) L1#2.2
NetC1#2_1: C1#2.1 L1#2.1
NetC1#2_2: C1#2.2 R1#2.2
NetC2#2_1: C2#2.1 R2#2.1
NetC2#2_2: C2#2.2 L2.2
NetL2_1: L2.1 R2#2.2

### Library data of the parts
BAT? = BAT_CN
C1#2 C2#2 = Cap semi: Capacitor (Semiconductor SIM Model); Value: 0.1uF; Published: 8-Jun-2000; LatestRevisionDate: 29-May-2009; LatestRevisionNote: IPC-7351 Footprint Added.; PackageReference: C1206; Publisher: Altium Limited; PackageDescription: Chip Capacitor
L1#2 L2 = Inductor: Code_IEC: 1005; Value: 2.2uH; Published: 8-Jun-2000; LatestRevisionDate: 29-May-2009; LatestRevisionNote: IPC-7351 Footprint Added.; PackageReference: 0402-A; Publisher: Altium Limited; PackageDescription: Chip Inductor; Code_JEITA: 0402
R1#2 R2#2 = Res2: Resistor; Value: 1M; Published: 8-Jun-2000; LatestRevisionDate: 17-Jul-2002; LatestRevisionNote: Re-released for DXP Platform.; PackageReference: AXIAL-0.4; Publisher: Altium Limited

## Nets that join several sheets
3V3: Activity_Recognition_Board_v1.0_MCU (7 pins), Activity_Recognition_Board_v1.0_Power (R20.1 R29.1 R30.1), Activity_Recognition_Board_v1.0_Sensor (C34.1 C35.1 R37.2), Activity_Recognition_Board_v1.0_Dispay_store (R39.2), Activity_Recognition_Board_v1.0_Audio (C36.1 C37.1 R40.2)
GND: Activity_Recognition_Board_v1.0_MCU (24 pins), Activity_Recognition_Board_v1.0_Power (15 pins), Activity_Recognition_Board_v1.0_Sensor (16 pins), Activity_Recognition_Board_v1.0_Dispay_store (24 pins), Activity_Recognition_Board_v1.0_Audio (18 pins)
CHG_STAT: Activity_Recognition_Board_v1.0_MCU (U2.14), Activity_Recognition_Board_v1.0_Power (R30.2 U4.8)
I2C_SCL: Activity_Recognition_Board_v1.0_MCU (U2.58), Activity_Recognition_Board_v1.0_Audio (U9.16)
I2C_SDA: Activity_Recognition_Board_v1.0_MCU (U2.59), Activity_Recognition_Board_v1.0_Audio (U9.17)
I2S_CK: Activity_Recognition_Board_v1.0_MCU (U2.34), Activity_Recognition_Board_v1.0_Audio (U9.8)
I2S_ext_SD: Activity_Recognition_Board_v1.0_MCU (U2.10), Activity_Recognition_Board_v1.0_Audio (U9.9)
I2S_MCK: Activity_Recognition_Board_v1.0_MCU (U2.37), Activity_Recognition_Board_v1.0_Audio (U9.11)
I2S_SD: Activity_Recognition_Board_v1.0_MCU (U2.11), Activity_Recognition_Board_v1.0_Audio (U9.10)
I2S_WS: Activity_Recognition_Board_v1.0_MCU (U2.33), Activity_Recognition_Board_v1.0_Audio (U9.7)
MPU_SCL: Activity_Recognition_Board_v1.0_MCU (U2.61), Activity_Recognition_Board_v1.0_Sensor (R32.1 U6.23)
MPU_SDA: Activity_Recognition_Board_v1.0_MCU (U2.62), Activity_Recognition_Board_v1.0_Sensor (R34.1 U6.24)
OLED_CS: Activity_Recognition_Board_v1.0_MCU (U2.24), Activity_Recognition_Board_v1.0_Dispay_store (U1.13)
OLED_DC: Activity_Recognition_Board_v1.0_MCU (U2.26), Activity_Recognition_Board_v1.0_Dispay_store (U1.15)
OLED_MOSI: Activity_Recognition_Board_v1.0_MCU (U2.23), Activity_Recognition_Board_v1.0_Dispay_store (U1.19)
OLED_RES: Activity_Recognition_Board_v1.0_MCU (U2.25), Activity_Recognition_Board_v1.0_Dispay_store (U1.14)
OLED_SCK: Activity_Recognition_Board_v1.0_MCU (U2.21), Activity_Recognition_Board_v1.0_Dispay_store (U1.18)
PG_STAT: Activity_Recognition_Board_v1.0_MCU (U2.9), Activity_Recognition_Board_v1.0_Power (R29.2 U4.5)
Power_ADC: Activity_Recognition_Board_v1.0_MCU (U2.27), Activity_Recognition_Board_v1.0_Power (C22.2 R18.2 R19.1)
SD_CD/DATA3: Activity_Recognition_Board_v1.0_MCU (U2.52), Activity_Recognition_Board_v1.0_Dispay_store (R3.1 SD1.2)
SD_CLK: Activity_Recognition_Board_v1.0_MCU (U2.53), Activity_Recognition_Board_v1.0_Dispay_store (SD1.5)
SD_CMD: Activity_Recognition_Board_v1.0_MCU (U2.54), Activity_Recognition_Board_v1.0_Dispay_store (R4.1 SD1.3)
SD_DATA0: Activity_Recognition_Board_v1.0_MCU (U2.39), Activity_Recognition_Board_v1.0_Dispay_store (R5.1 SD1.7)
SD_DATA1: Activity_Recognition_Board_v1.0_MCU (U2.40), Activity_Recognition_Board_v1.0_Dispay_store (R6.1 SD1.8)
SD_DATA2: Activity_Recognition_Board_v1.0_MCU (U2.51), Activity_Recognition_Board_v1.0_Dispay_store (R2#1.1 SD1.1)
SD_SD: Activity_Recognition_Board_v1.0_MCU (U2.55), Activity_Recognition_Board_v1.0_Dispay_store (R8.2)
Sensors_I2C_SCL: Activity_Recognition_Board_v1.0_MCU (U2.29), Activity_Recognition_Board_v1.0_Sensor (R36.1 U5.6 U7.5 U8.6)
Sensors_I2C_SDA: Activity_Recognition_Board_v1.0_MCU (U2.30), Activity_Recognition_Board_v1.0_Sensor (R35.1 U5.4 U7.6 U8.1)
USB_DM: Activity_Recognition_Board_v1.0_MCU (U2.44), Activity_Recognition_Board_v1.0_Power (R21.1)
USB_DP: Activity_Recognition_Board_v1.0_MCU (U2.45), Activity_Recognition_Board_v1.0_Power (R23.1)
USB_ID: Activity_Recognition_Board_v1.0_MCU (U2.15), Activity_Recognition_Board_v1.0_Power (R25.1)